# Altium schematic sheet Sheet4.SchDoc
size A4
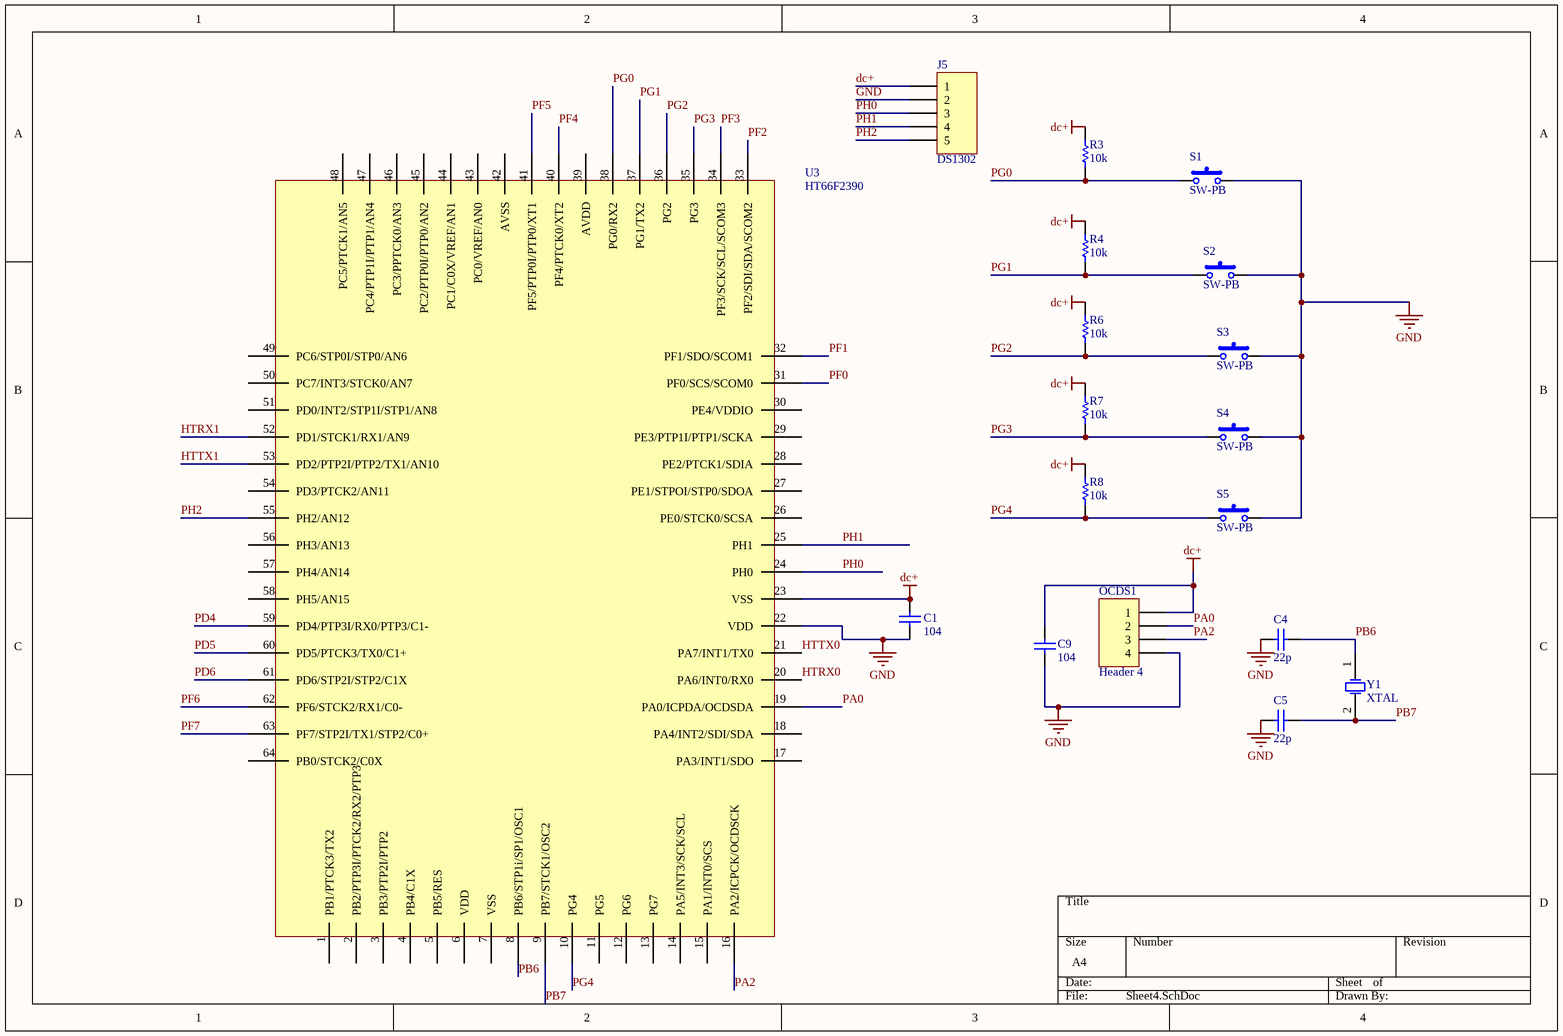
[diagram p0: Sheet4.SchDoc]

## Parts
C1  104  [C200]
C4  22p  [C200]
C5  22p  [C200]
C9  104  [C200]
J5  DS1302  [HDR1X5]
OCDS1  Header 4  [HDR1X4]
R3  10k  [AXIAL-0.3]
R4  10k  [AXIAL-0.3]
R6  10k  [AXIAL-0.3]
R7  10k  [AXIAL-0.3]
R8  10k  [AXIAL-0.3]
S1  SW-PB  [TACK6]
S2  SW-PB  [TACK6]
S3  SW-PB  [TACK6]
S4  SW-PB  [TACK6]
S5  SW-PB  [TACK6]
U3  HT66F2390  [LFPQ-64]
Y1  XTAL  [XTAL4-8]

## Nets
dc+: C1.2 C9.2 J5.1 OCDS1.1 R3.2 R4.1 R6.1 R7.1 R8.1 U3.23(VSS)
GND: C1.1 C4.1 C5.1 C9.1 J5.2 OCDS1.4 S1.2 S2.2 S3.2 S4.2 S5.2 U3.22(VDD)
HTRX0: U3.20(PA6/INT0/RX0)
HTRX1: U3.52(PD1/STCK1/RX1/AN9)
HTTX0: U3.21(PA7/INT1/TX0)
HTTX1: U3.53(PD2/PTP2I/PTP2/TX1/AN10)
PA0: OCDS1.2 U3.19(PA0/ICPDA/OCDSDA)
PA2: OCDS1.3 U3.16(PA2/ICPCK/OCDSCK)
PB6: C4.2 U3.8(PB6/STP1i/SP1/OSC1) Y1.1(OSC1)
PB7: C5.2 U3.9(PB7/STCK1/OSC2) Y1.2(OSC2)
PD4: U3.59(PD4/PTP3I/RX0/PTP3/C1-)
PD5: U3.60(PD5/PTCK3/TX0/C1+)
PD6: U3.61(PD6/STP2I/STP2/C1X)
PF0: U3.31(PF0/SCS/SCOM0)
PF1: U3.32(PF1/SDO/SCOM1)
PF2: U3.33(PF2/SDI/SDA/SCOM2)
PF3: U3.34(PF3/SCK/SCL/SCOM3)
PF4: U3.40(PF4/PTCK0/XT2)
PF5: U3.41(PF5/PTP0I/PTP0/XT1)
PF6: U3.62(PF6/STCK2/RX1/C0-)
PF7: U3.63(PF7/STP2I/TX1/STP2/C0+)
PG0: R3.1 S1.1 U3.38(PG0/RX2)
PG1: R4.2 S2.1 U3.37(PG1/TX2)
PG2: R6.2 S3.1 U3.36(PG2)
PG3: R7.2 S4.1 U3.35(PG3)
PG4: R8.2 S5.1 U3.10(PG4)
PH0: J5.3 U3.24(PH0)
PH1: J5.4 U3.25(PH1)
PH2: J5.5 U3.55(PH2/AN12)

Not connected (* = marked no-connect by the designer): U3 1(PB1/PTCK3/TX2) 2(PB2/PTP3I/PTCK2/RX2/PTP3) 3(PB3/PTP2I/PTP2) 4(PB4/C1X) 5(PB5/RES) 6(VDD) 7(VSS) 11(PG5) 12(PG6) 13(PG7) 14(PA5/INT3/SCK/SCL) 15(PA1/INT0/SCS) 17(PA3/INT1/SDO) 18(PA4/INT2/SDI/SDA) 26(PE0/STCK0/SCSA) 27(PE1/STPOI/STP0/SDOA) 28(PE2/PTCK1/SDIA) 29(PE3/PTP1I/PTP1/SCKA) 30(PE4/VDDIO) 39(AVDD) 42(AVSS) 43(PC0/VREF/AN0) 44(PC1/C0X/VREF/AN1) 45(PC2/PTP0I/PTP0/AN2) 46(PC3/PPTCK0/AN3) 47(PC4/PTP1I/PTP1/AN4) 48(PC5/PTCK1/AN5) 49(PC6/STP0I/STP0/AN6) 50(PC7/INT3/STCK0/AN7) 51(PD0/INT2/STP1I/STP1/AN8) 54(PD3/PTCK2/AN11) 56(PH3/AN13) 57(PH4/AN14) 58(PH5/AN15) 64(PB0/STCK2/C0X)

## Library data of the parts
C1 C4 C5 C9 = Cap: Capacitor; Published: 8-Jun-2000; LatestRevisionDate: 17-Jul-2002; LatestRevisionNote: Re-released for DXP Platform.; PackageReference: RAD-0.3; Publisher: Altium Limited
J5 = Header 5: Header, 5-Pin; LatestRevisionDate: 17-Jul-2002; LatestRevisionNote: Re-released for DXP Platform.; Publisher: Altium Limited
OCDS1 = Header 4: Header, 4-Pin; LatestRevisionDate: 17-Jul-2002; LatestRevisionNote: Re-released for DXP Platform.; Publisher: Altium Limited
R3 R4 R6-R8 = Res: Resistor; Published: 8-Jun-2000; LatestRevisionDate: 17-Jul-2002; LatestRevisionNote: Re-released for DXP Platform.; PackageReference: AXIAL-0.3; Publisher: Altium Limited
S1-S5 = SW-PB: Switch; Published: 24-Mar-1999; LatestRevisionDate: 17-Jul-2002; LatestRevisionNote: Re-released for DXP Platform.; PackageReference: SPST-2; Publisher: Altium Limited
Y1 = XTAL: Crystal Oscillator; Published: 8-Jun-2000; LatestRevisionDate: 17-Jul-2002; LatestRevisionNote: Re-released for DXP Platform.; PackageReference: R38; Publisher: Altium Limited